# Altium schematic sheet SUBBOARD-power_stage.SchDoc
size A4
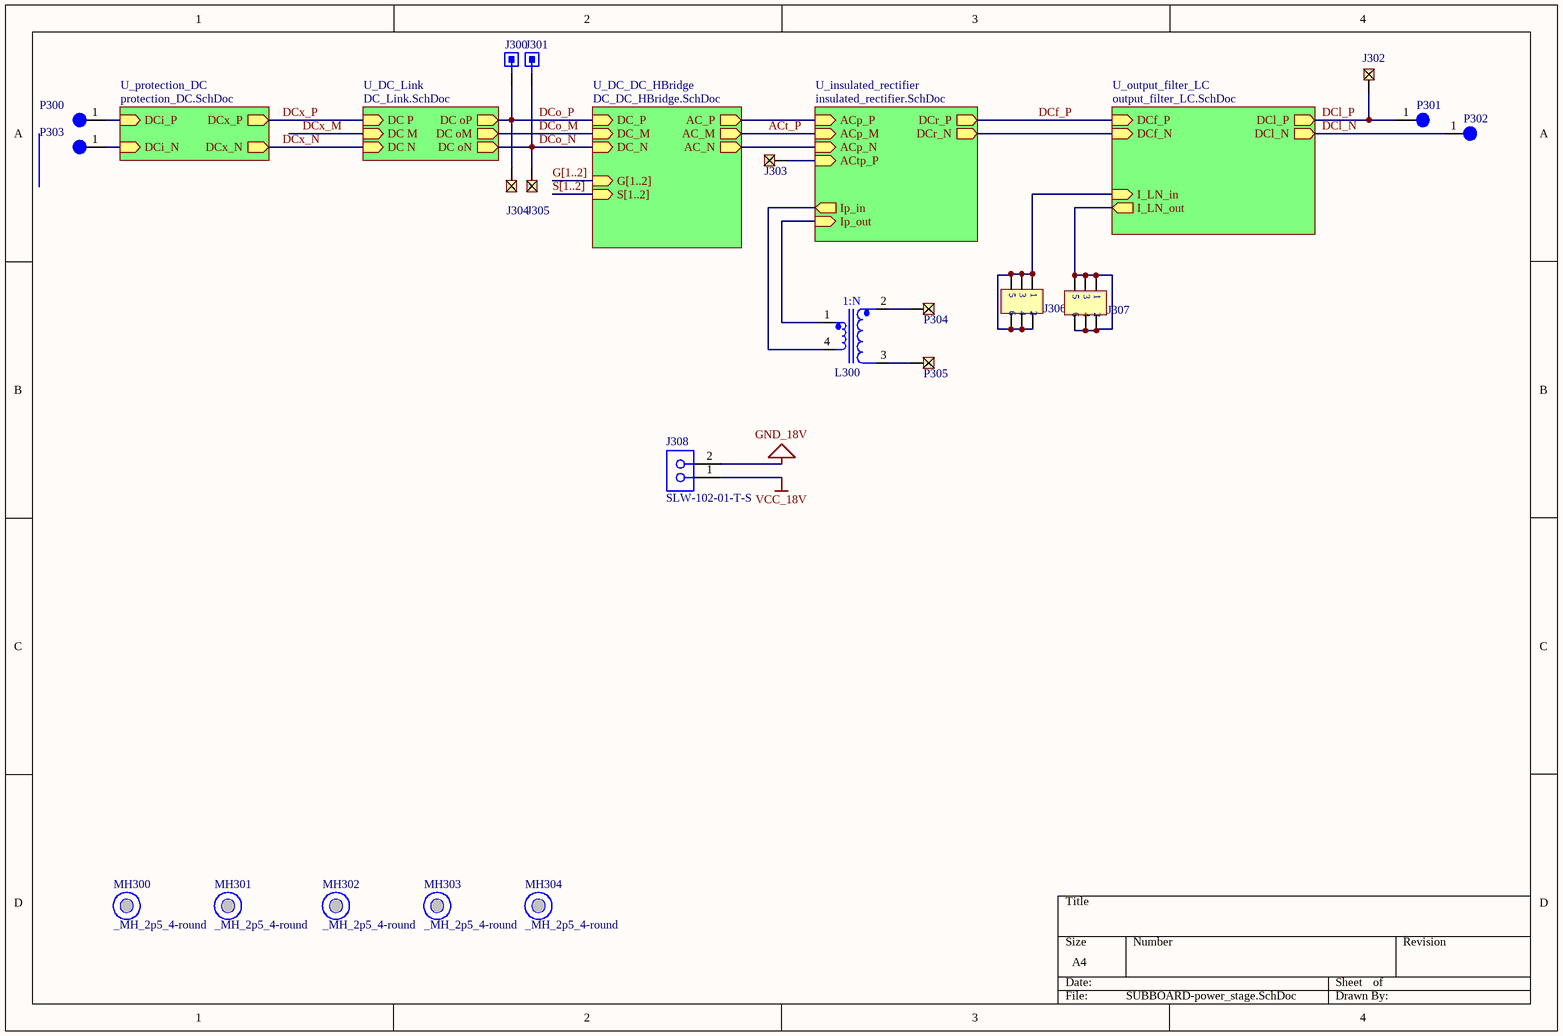
[diagram p0: SUBBOARD-power_stage.SchDoc]

## Parts
J300  CES-101-01-T-S  [CES-101-01-T-S]  (value not drawn)
J301  CES-101-01-T-S  [CES-101-01-T-S]  (value not drawn)
J302  SSW-101-01-G-S  [SAM1209-01-ND]  (value not drawn)
J303  SSW-101-01-G-S  [SAM1209-01-ND]  (value not drawn)
J304  SSW-101-01-G-S  [SAM1209-01-ND]  (value not drawn)
J305  SSW-101-01-G-S  [SAM1209-01-ND]  (value not drawn)
J306  SSW-103-01-G-D  [SSW-103-01-G-D]  (value not drawn)
J307  SSW-103-01-G-D  [SSW-103-01-G-D]  (value not drawn)
J308  SLW-102-01-T-S  [SMTC-SLW-102-01-X-S]
L300  PA0368.050NLT  [PA0368.050NLT]  (value not drawn)
MH300  _MH_2p5_4-round  [_MH_2p5_4-round]
MH301  _MH_2p5_4-round  [_MH_2p5_4-round]
MH302  _MH_2p5_4-round  [_MH_2p5_4-round]
MH303  _MH_2p5_4-round  [_MH_2p5_4-round]
MH304  _MH_2p5_4-round  [_MH_2p5_4-round]
P300  Test_Point_1p7  [_TP_1p7]  (value not drawn)
P301  Test_Point_3_4p5_square_vias  [_TP_3_4p5_square_vias]  (value not drawn)
P302  Test_Point_3_4p5_square_vias  [_TP_3_4p5_square_vias]  (value not drawn)
P303  Test_Point_1p7  [_TP_1p7]  (value not drawn)
P304  SSW-101-01-G-S  [SAM1209-01-ND]  (value not drawn)
P305  SSW-101-01-G-S  [SAM1209-01-ND]  (value not drawn)

## Sub-sheets
U_DC_DC_HBridge = DC_DC_HBridge.SchDoc: DC_P (in), DC_M (in), DC_N (in), AC_P (out), AC_N (out), AC_M (out), G[1..2] (in), S[1..2] (in)
U_DC_Link = DC_Link.SchDoc: DC P (in), DC M (in), DC N (in), DC oP (out), DC oM (out), DC oN (out)
U_insulated_rectifier = insulated_rectifier.SchDoc: ACp_P (in), ACp_N (in), DCr_P (out), DCr_N (out), Ip_out (in), Ip_in (out), ACp_M (in), ACtp_P (in)
U_output_filter_LC = output_filter_LC.SchDoc: DCf_N (in), DCl_N (out), DCl_P (out), DCf_P (in), I_LN_in (in), I_LN_out (out)
U_protection_DC = protection_DC.SchDoc: DCx_P (out), DCx_N (out), DCi_P (in), DCi_N (in)

## Nets
GND_18V: J308.2
VCC_18V: J308.1
ACt_P: sheet U_insulated_rectifier/ACp_M, sheet U_DC_DC_HBridge/AC_M
DCf_P: sheet U_insulated_rectifier/DCr_P, sheet U_output_filter_LC/DCf_P
DCl_N: P302.1 ; sheet U_output_filter_LC/DCl_N
DCl_P: J302.1 P301.1 ; sheet U_output_filter_LC/DCl_P
DCo_M: sheet U_DC_Link/DC oM, sheet U_DC_DC_HBridge/DC_M
DCo_N: J301.1 J305.1 ; sheet U_DC_Link/DC oN, sheet U_DC_DC_HBridge/DC_N
DCo_P: J300.1 J304.1 ; sheet U_DC_Link/DC oP, sheet U_DC_DC_HBridge/DC_P
DCx_M: sheet U_DC_Link/DC M
DCx_N: sheet U_DC_Link/DC N, sheet U_protection_DC/DCx_N
DCx_P: sheet U_DC_Link/DC P, sheet U_protection_DC/DCx_P
NetJ303_1: J303.1 ; sheet U_insulated_rectifier/ACtp_P
NetJ306_1: J306.1 J306.2 J306.3 J306.4 J306.5 J306.6 ; sheet U_output_filter_LC/I_LN_in
NetJ307_1: J307.1 J307.2 J307.3 J307.4 J307.5 J307.6 ; sheet U_output_filter_LC/I_LN_out
NetL300_1: L300.1 ; sheet U_insulated_rectifier/Ip_out
NetL300_2: L300.2 P304.1
NetL300_3: L300.3 P305.1
NetL300_4: L300.4 ; sheet U_insulated_rectifier/Ip_in
NetP300_1: P300.1 ; sheet U_protection_DC/DCi_P
NetP303_1: P303.1 ; sheet U_protection_DC/DCi_N
(unnamed): sheet U_insulated_rectifier/ACp_P, sheet U_DC_DC_HBridge/AC_P
(unnamed): sheet U_insulated_rectifier/ACp_N, sheet U_DC_DC_HBridge/AC_N
(unnamed): sheet U_insulated_rectifier/DCr_N, sheet U_output_filter_LC/DCf_N

## Buses and harness runs
bus G[1..2] = sheet U_DC_DC_HBridge/G[1..2]
bus S[1..2] = sheet U_DC_DC_HBridge/S[1..2]

## Notes on the sheet
- (in symbol PA0368.050NLT) 1:N

## Library data of the parts
J300 J301 = CES-101-01-T-S: Conn Socket Strip SKT 1 POS Solder ST Thru-Hole; Manufacturer: Samtec; Connector Type: Receptacle; Number of Positions: 1; System: Connector; Supplier 1: Digi-Key; Manufacturer Part Number: CES-101-01-T-S; RoHS: Yes; Category: Connectors; Stock 1: 3369; Pricing 1: 1=0.18000, 10=0.16800, 25=0.12520, 50=0.10720, 100=0.10370, 250=0.08940, 500=0.08582 (USD); Mount: Through Hole; Color: Black; Contact Plating: Tin; Contact Material: Bronze; Housing Material: Plastic; Housing Color: Black; Number of Rows: 1; Packaging: Bulk; Termination: Solder; Gender: Receptacle; Number of Contacts: 1; Package Quantity: 1; Length: 2.54mm; Height: 5.08mm; Width: 3.05mm; Radiation Hardening: No; Lead Free: Lead Free; REACH SVHC: No SVHC; ComponentLink1URL: https://datasheet.ciiva.com/413/ces-mkt-413326.pdf?src-supplier=Digi-Key; ComponentLink1Description: https://datasheet.ciiva.com/413/ces-mkt-413326.pdf?src-supplier=Digi-Key; Supplier Part Number 1: SAM1087-01-ND
J302-J305 P304 P305 = SSW-101-01-G-S: CLEAR GLOVE BX 100 M - More Details; Manufacturer: Samtec; Connector Type: Receptacle,Socket; Number of Positions: 1; Gender: Receptacle; Max Current Rating: 6.9A; Max Voltage Rating (AC): 550V; Mating Cycles: 100; Contact Resistance: 10mR; System: Connector; Supplier 1: Digi-Key; Manufacturer Part Number: SSW-101-01-G-S; RoHS: Yes; Category: Connectors; Stock 1: 10228; Pricing 1: 1=0.25000, 10=0.23600, 25=0.20120, 50=0.17600, 100=0.16350, 250=0.14464, 500=0.13834 (USD); Mount: Through Hole; Contact Plating: Gold; Contact Material: Bronze; Color: Black; Housing Material: Polymer; Housing Color: Black; Min Operating Temperature: -55°C; Max Operating Temperature: 125°C; Packaging: Bulk; Termination: Solder; Number of Contacts: 1; Number of Rows: 1; Orientation: Straight; Length: 3.05mm; Width: 2.41mm; Depth: 2.41mm; Radiation Hardening: No; Lead Free: Lead Free; REACH SVHC: No SVHC; ComponentLink1URL: https://datasheet.ciiva.com/749/ssw-1xx-xx-xxx-x-xx-xxx-xx-mkt-749879.pdf?src-supplier=Digi-Key; ComponentLink1Description: https://datasheet.ciiva.com/749/ssw-1xx-xx-xxx-x-xx-xxx-xx-mkt-749879.pdf?src-supplier=Digi-Key; Supplier Part Number 1: SAM1209-01-ND
J306 J307 = SSW-103-01-G-D: Conn Socket Strip SKT 6 POS 2.54mm Solder ST Thru-Hole; Manufacturer: Samtec; Number of Contacts: 6; Gender: Receptacle; Connector Type: Receptacle,Socket; Contact Resistance: 10mR; Max Current Rating: 6.9A; Max Voltage Rating (AC): 550V; Mating Cycles: 100; Row Spacing: 0.1inch; Supplier 1: Digi-Key; Manufacturer Part Number: SSW-103-01-G-D; RoHS: Yes; Category: Headers and Wire Housings; Stock 1: 1397; Pricing 1: 1=0.93000, 10=0.82100, 25=0.77240, 50=0.74020, 100=0.70800, 250=0.64368, 500=0.57932 (USD); Mount: Through Hole; Contact Plating: Gold; Contact Material: Bronze; Color: Black; Housing Color: Black; Housing Material: Polymer; Min Operating Temperature: -55°C; Max Operating Temperature: 125°C; Number of Rows: 2; Termination: Solder; Packaging: Bulk; Number of Positions: 6; Orientation: Vertical; Current Rating: 6.9A; Voltage Rating: 550V; Length: 8.13mm; Pitch: 2.54mm; Depth: 4.95mm; Radiation Hardening: No; Lead Free: Lead Free; REACH SVHC: No SVHC; ComponentLink1URL: https://datasheet.ciiva.com/25617/0900766b8115c03d-25617399.pdf?src-supplier=RSComponents; ComponentLink1Description: https://datasheet.ciiva.com/25617/0900766b8115c03d-25617399.pdf?src-supplier=RSComponents; ComponentLink2URL: https://datasheet.ciiva.com/22677/82032-22677622.pdf?src-supplier=Element14; ComponentLink2Description: https://datasheet.ciiva.com/22677/82032-22677622.pdf?src-supplier=Element14; ComponentLink3URL: https://datasheet.ciiva.com/749/ssw-1xx-xx-xxx-x-xx-xxx-xx-mkt-749828.pdf?src-supplier=Digi-Key; ComponentLink3Description: https://datasheet.ciiva.com/749/ssw-1xx-xx-xxx-x-xx-xxx-xx-mkt-749828.pdf?src-supplier=Digi-Key; Supplier Part Number 1: SAM1208-03-ND
J308 = CMP-1023-00124-1: Low Profile Socket Strips, Through-hole, Vertical, -55 to 105 degC, 2.54 mm Pitch, 2-Pin, Female, RoHS; Manufacturer: Samtec; Pitch: 2.54 mm; System: Connector; ComponentLink2Description: Datasheet; PackageReference: SLW-102-01-X-S; Orientation: Vertical; PartNumber: SLW-102-01-T-S; ComponentLink3URL: http://www.samtec.com/documents/webfiles/cpdf/SLW-1XX-01-X-X-MKT.pdf; DatasheetVersion: F-214; Mounting Technology: Through-hole; ComponentLink3Description: Package Specification; ComponentLink2URL: http://www.samtec.com/documents/webfiles/pdf/SLW.PDF; PackageDescription: Low Profile Socket Strip; Temperature Range: -55 to 105 degC; ComponentLink1Description: Manufacturer URL; PackageVersion: X, 9/1987; RoHS: True; ComponentLink1URL: http://www.samtec.com
L300 = PA0368.050NLT: Current Transformer 1:50 500Vrms 0.004Ohm Prim. DCR 0.9Ohm Sec. DCR 4000mA Surface Mount; Manufacturer: Pulse; Frequency: 1kHz; Current Rating: 4A; Inductance: 1.7mH; DC Resistance (DCR): 4mR; Supplier 1: Digi-Key; Manufacturer Part Number: PA0368.050NLT; RoHS: Yes; Category: Inductors; Stock 1: 2736; Pricing 1: 1=2.28000, 10=1.82200, 25=1.48000, 50=1.44220, 100=1.40420, 250=1.36620, 500=1.35482 (USD); Mount: Surface Mount; Number of Pins: 4; Min Operating Temperature: -40°C; Max Operating Temperature: 130°C; Turns Ratio: 1:50; Packaging: Tape and Reel; Package Quantity: 1100; Termination: SMD/SMT; Length: 8.25mm; Height: 3.4mm; Width: 8.25mm; Height - Seated (Max): 3.4mm; Depth: 8.25mm; Radiation Hardening: No; ComponentLink1URL: https://datasheet.ciiva.com/3293/+spm2007-57-3293304.pdf?src-supplier=Avnet; ComponentLink1Description: https://datasheet.ciiva.com/3293/+spm2007-57-3293304.pdf?src-supplier=Avnet; ComponentLink2URL: https://datasheet.ciiva.com/17293/+spm2007-57-17293503.pdf?src-supplier=Avnet+Europe; ComponentLink2Description: https://datasheet.ciiva.com/17293/+spm2007-57-17293503.pdf?src-supplier=Avnet+Europe; Supplier Part Number 1: 553-3809-1-ND
MH300-MH304 = _MH_2p5_4-round: matching hole 2.5 hole, 4mm pad (round)
P300 P303 = Test_Point_1p7: Test point 1.7mm
P301 P302 = Test_Point_3_4p5_square_vias: Test point 4.5mm hole 3mm square connector with vias